# EAGLE schematic misko_1_board (EAGLE 9.6.2)
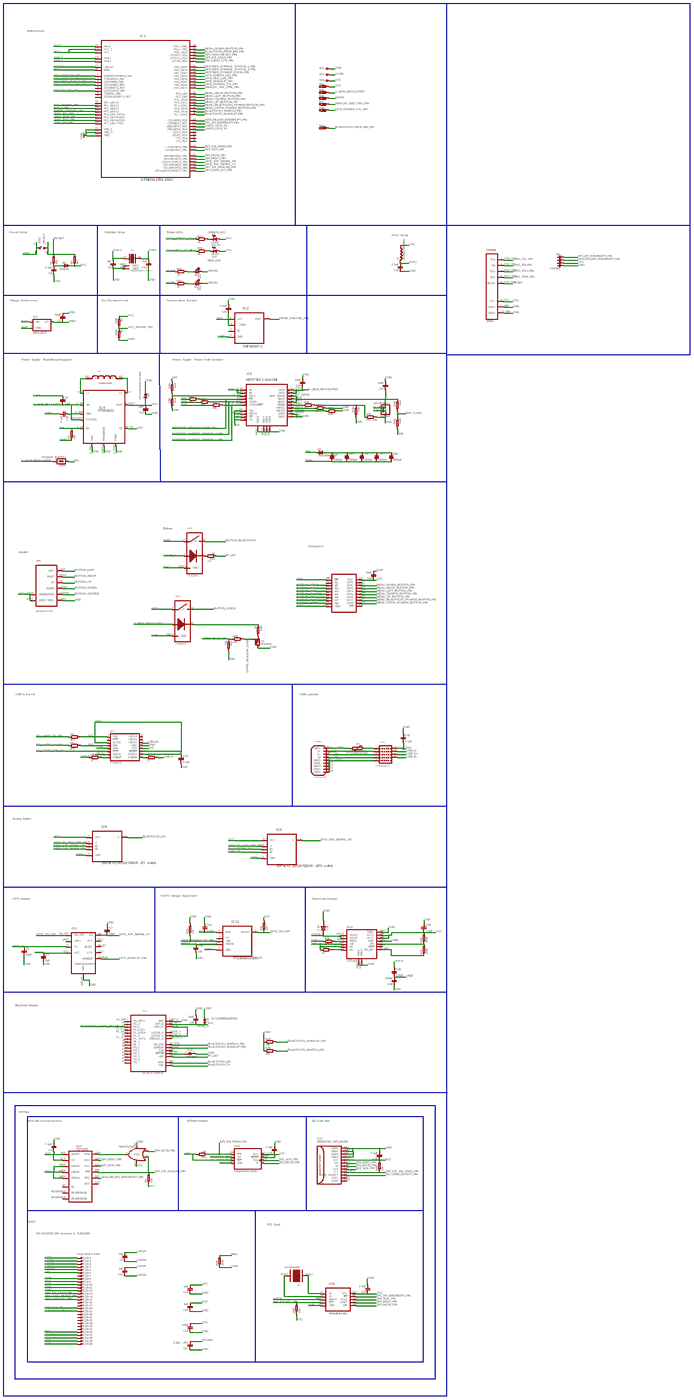
[diagram p0: schematic, sheet 1, overview]
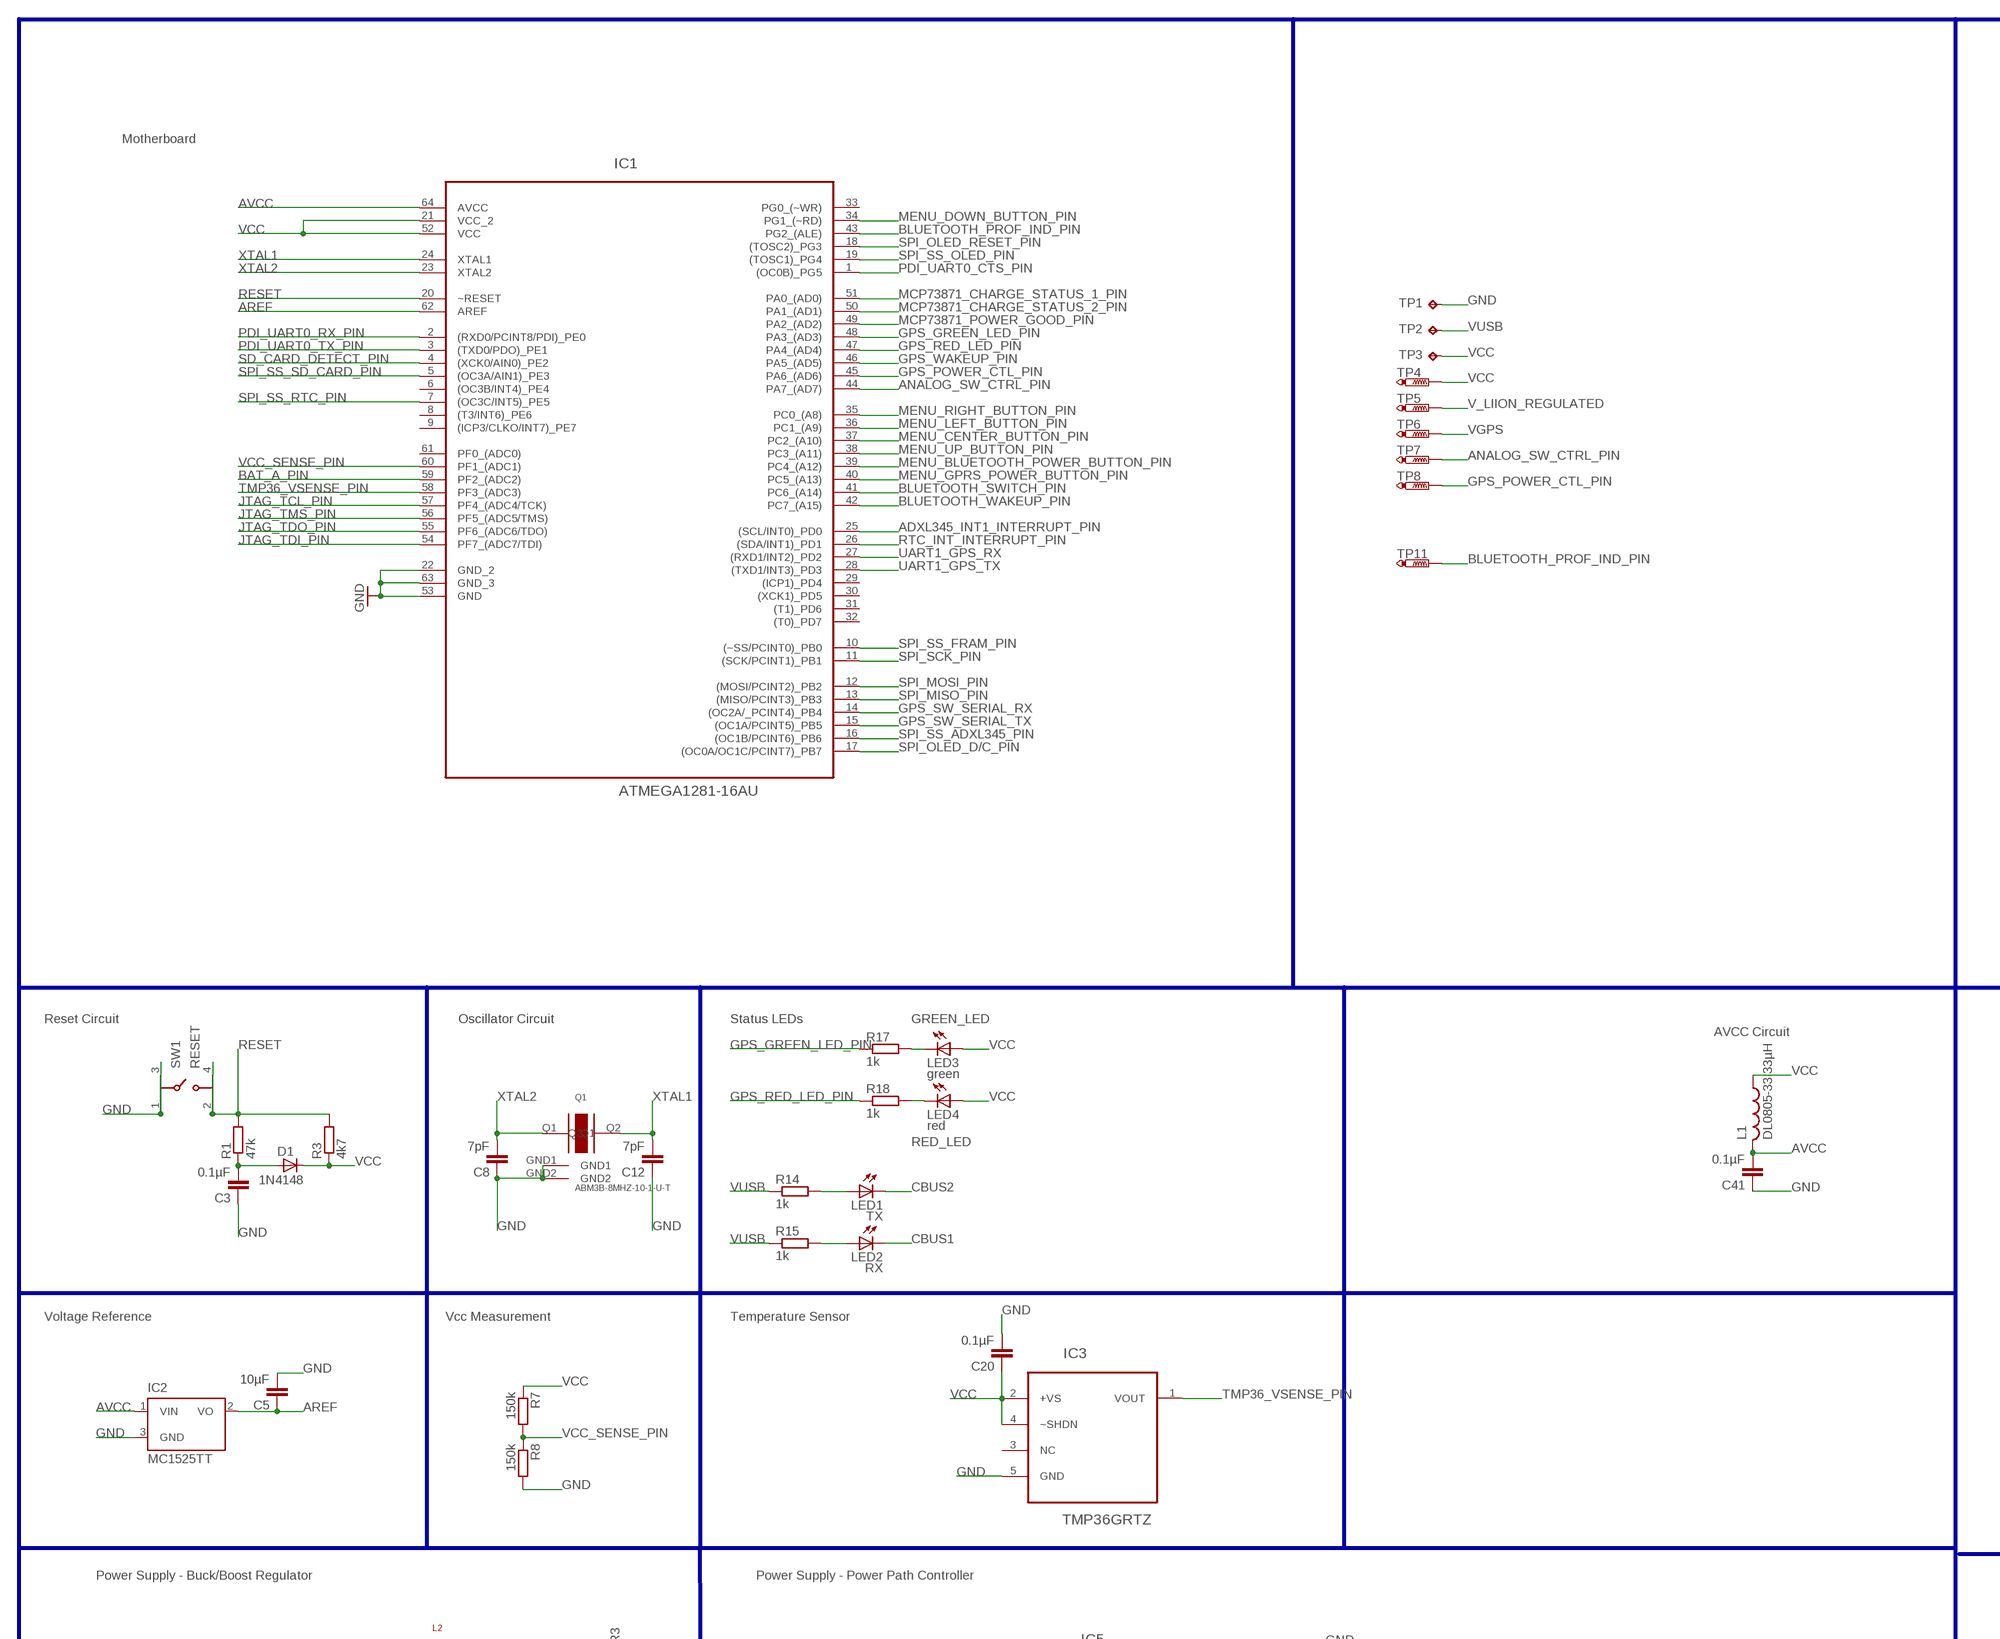
[diagram p1: schematic, sheet 1, part 1 of 5]
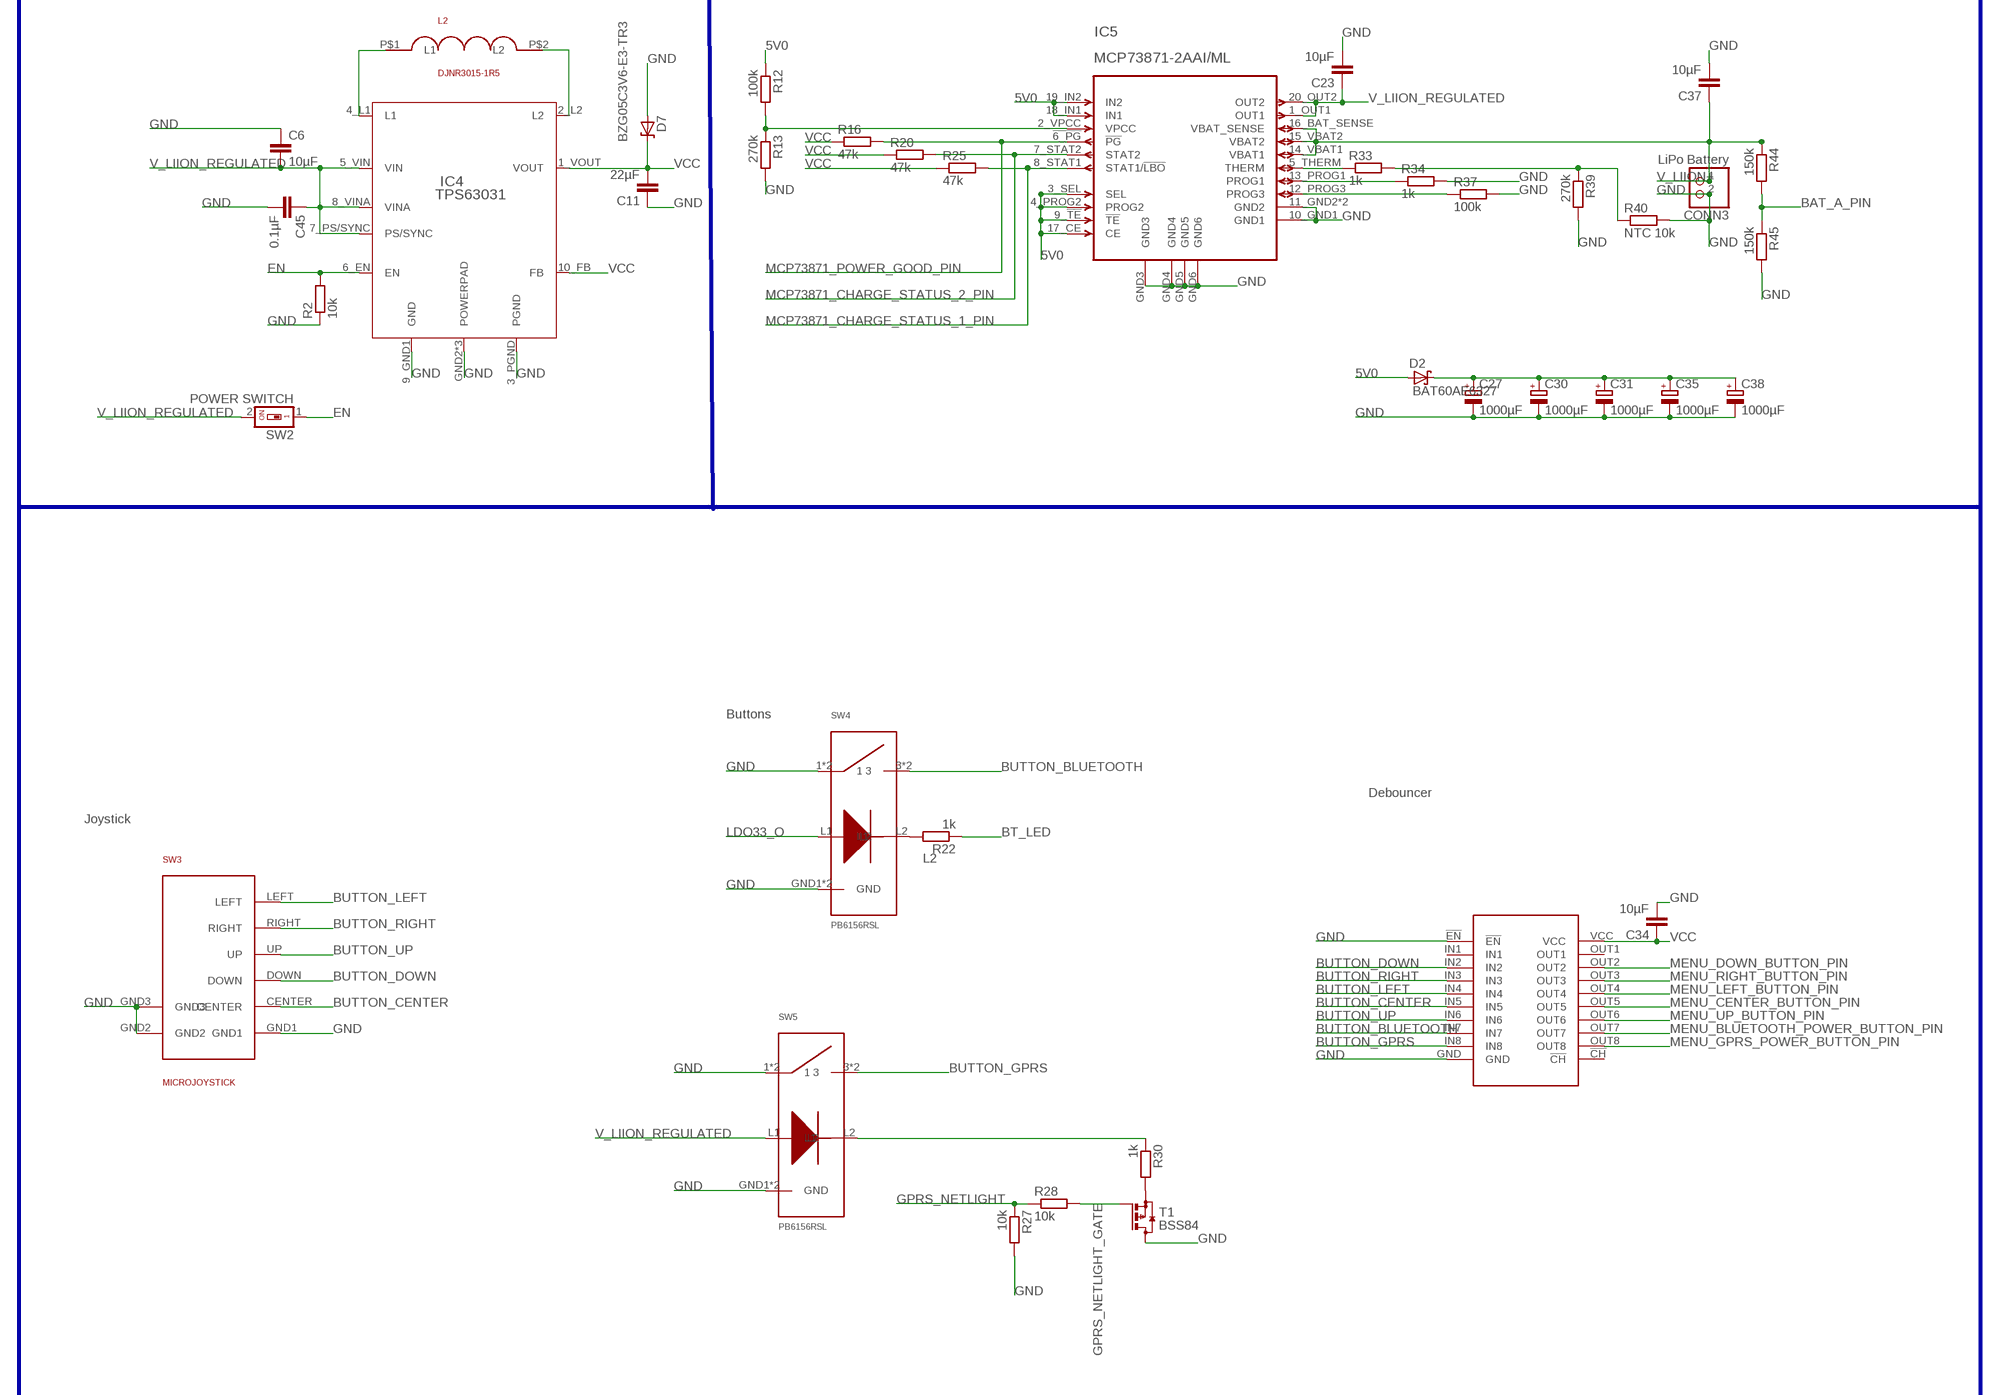
[diagram p2: schematic, sheet 1, part 2 of 5]
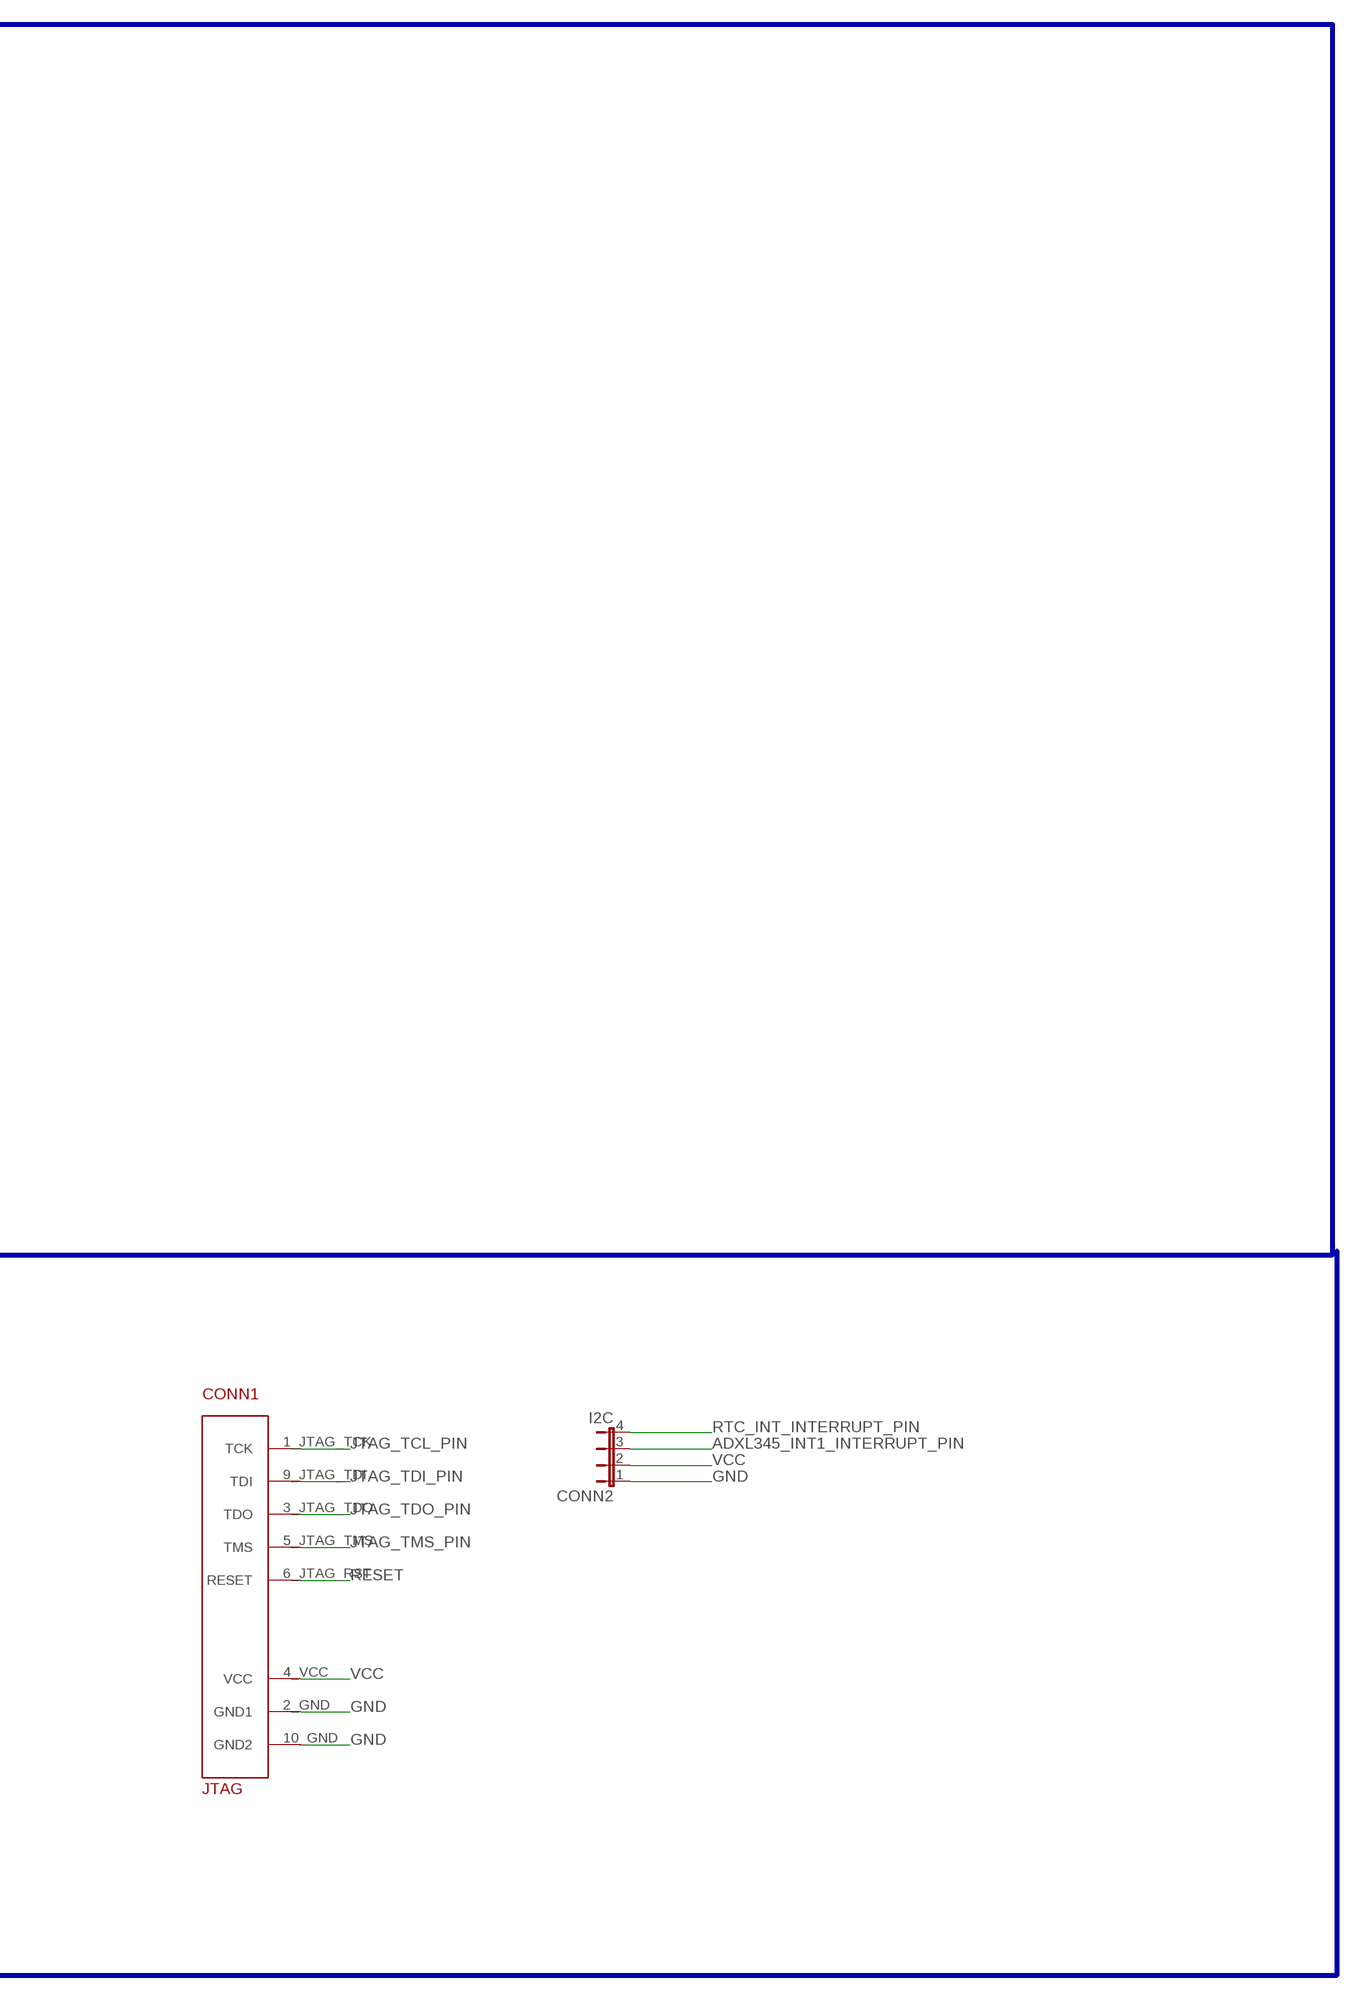
[diagram p3: schematic, sheet 1, part 3 of 5]
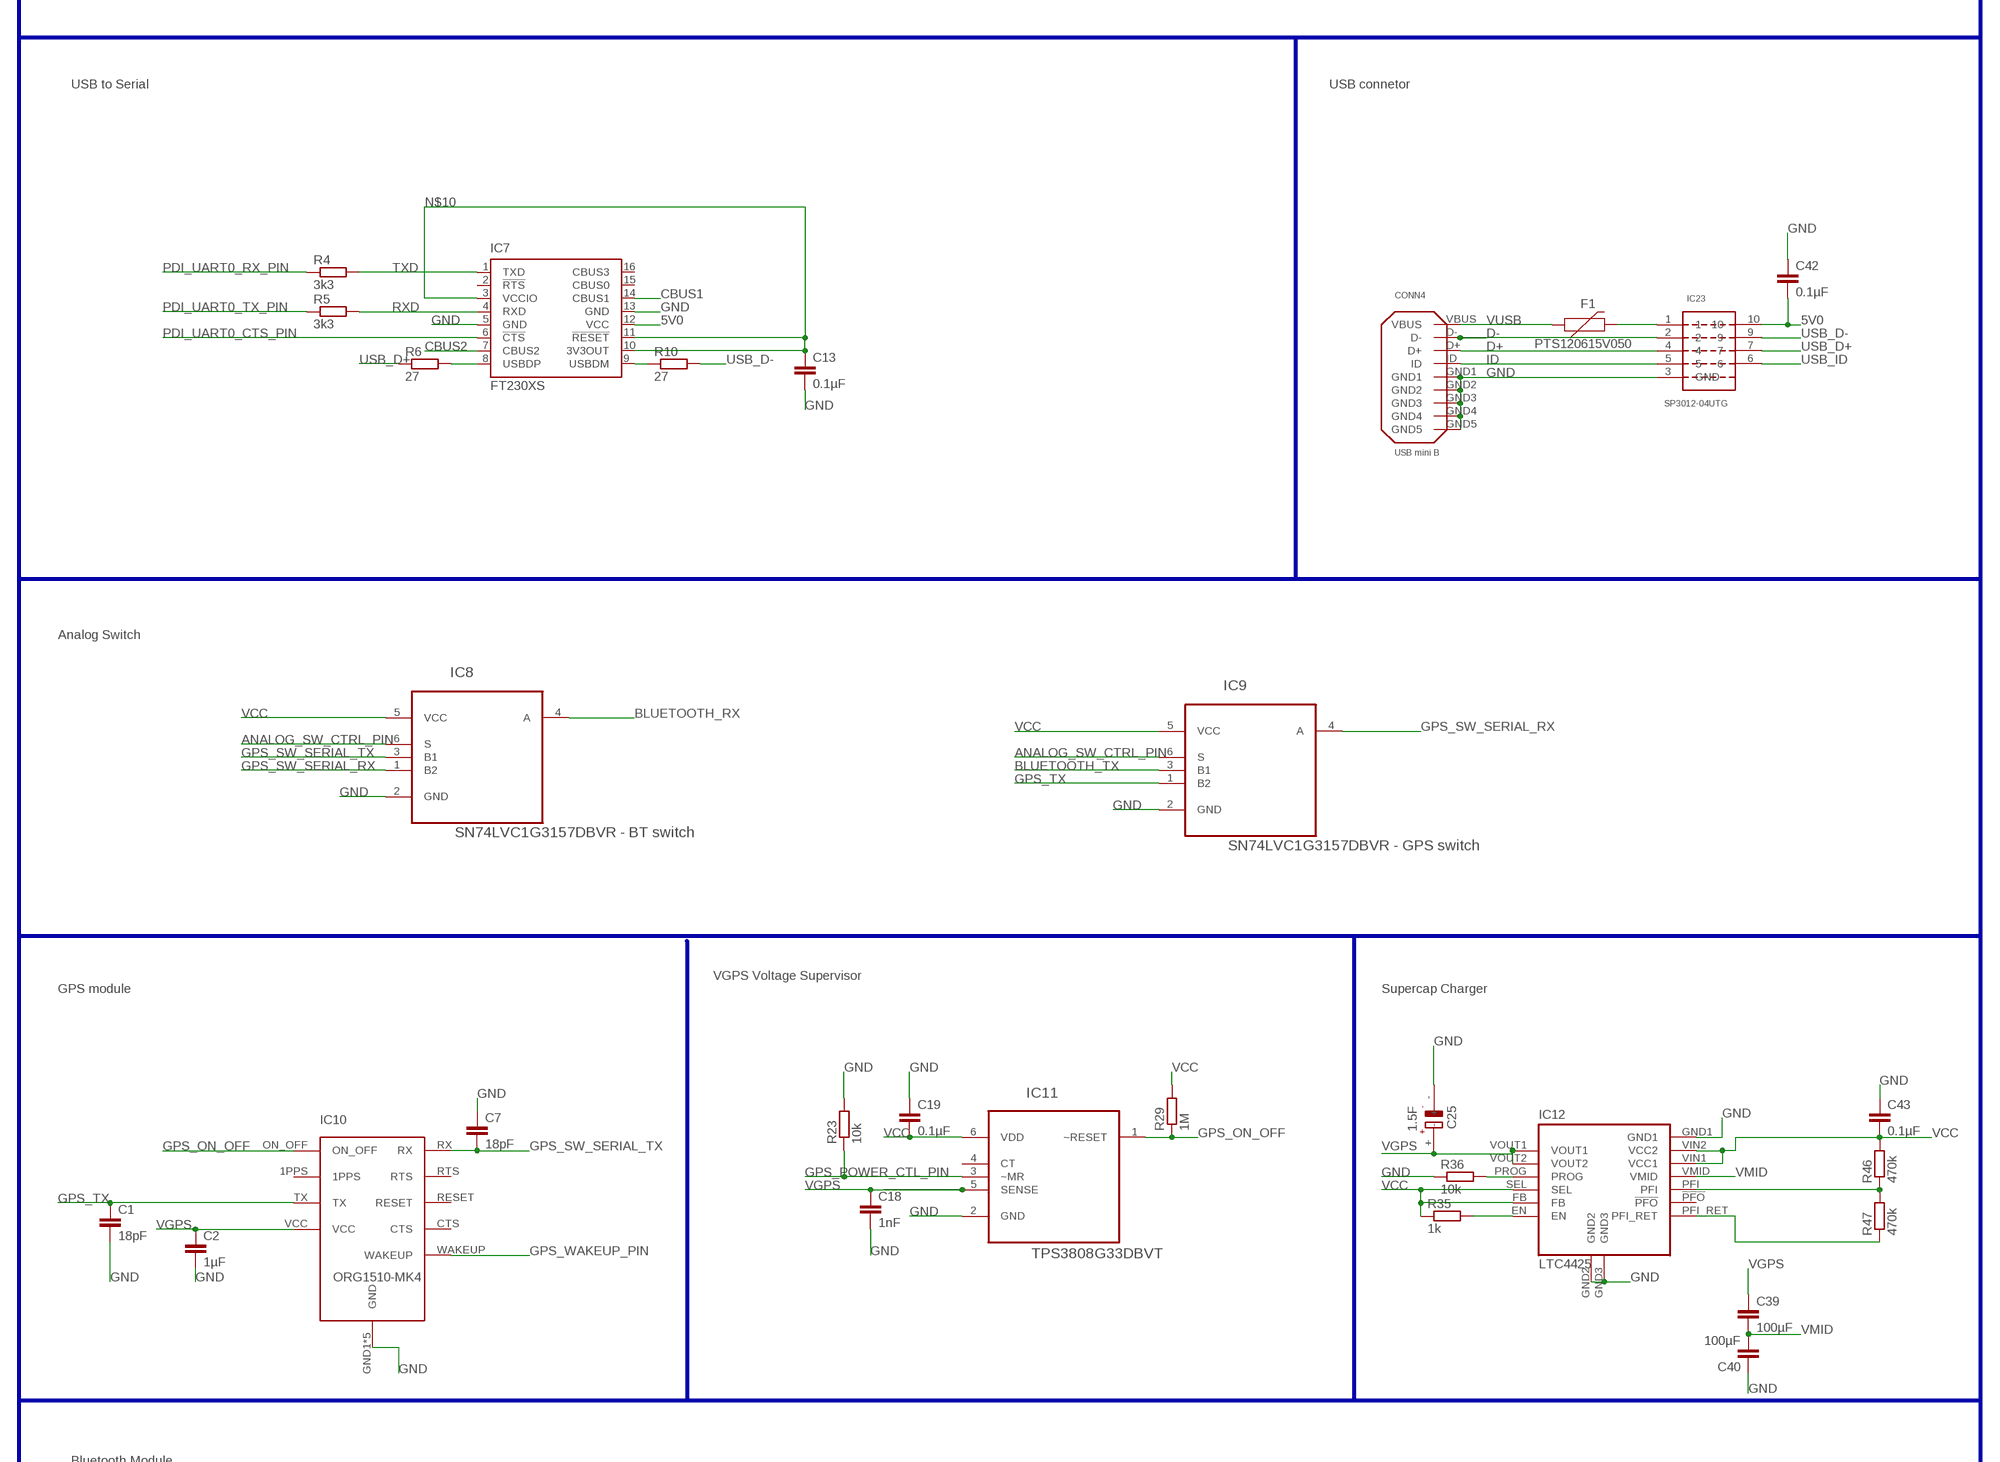
[diagram p4: schematic, sheet 1, part 4 of 5]
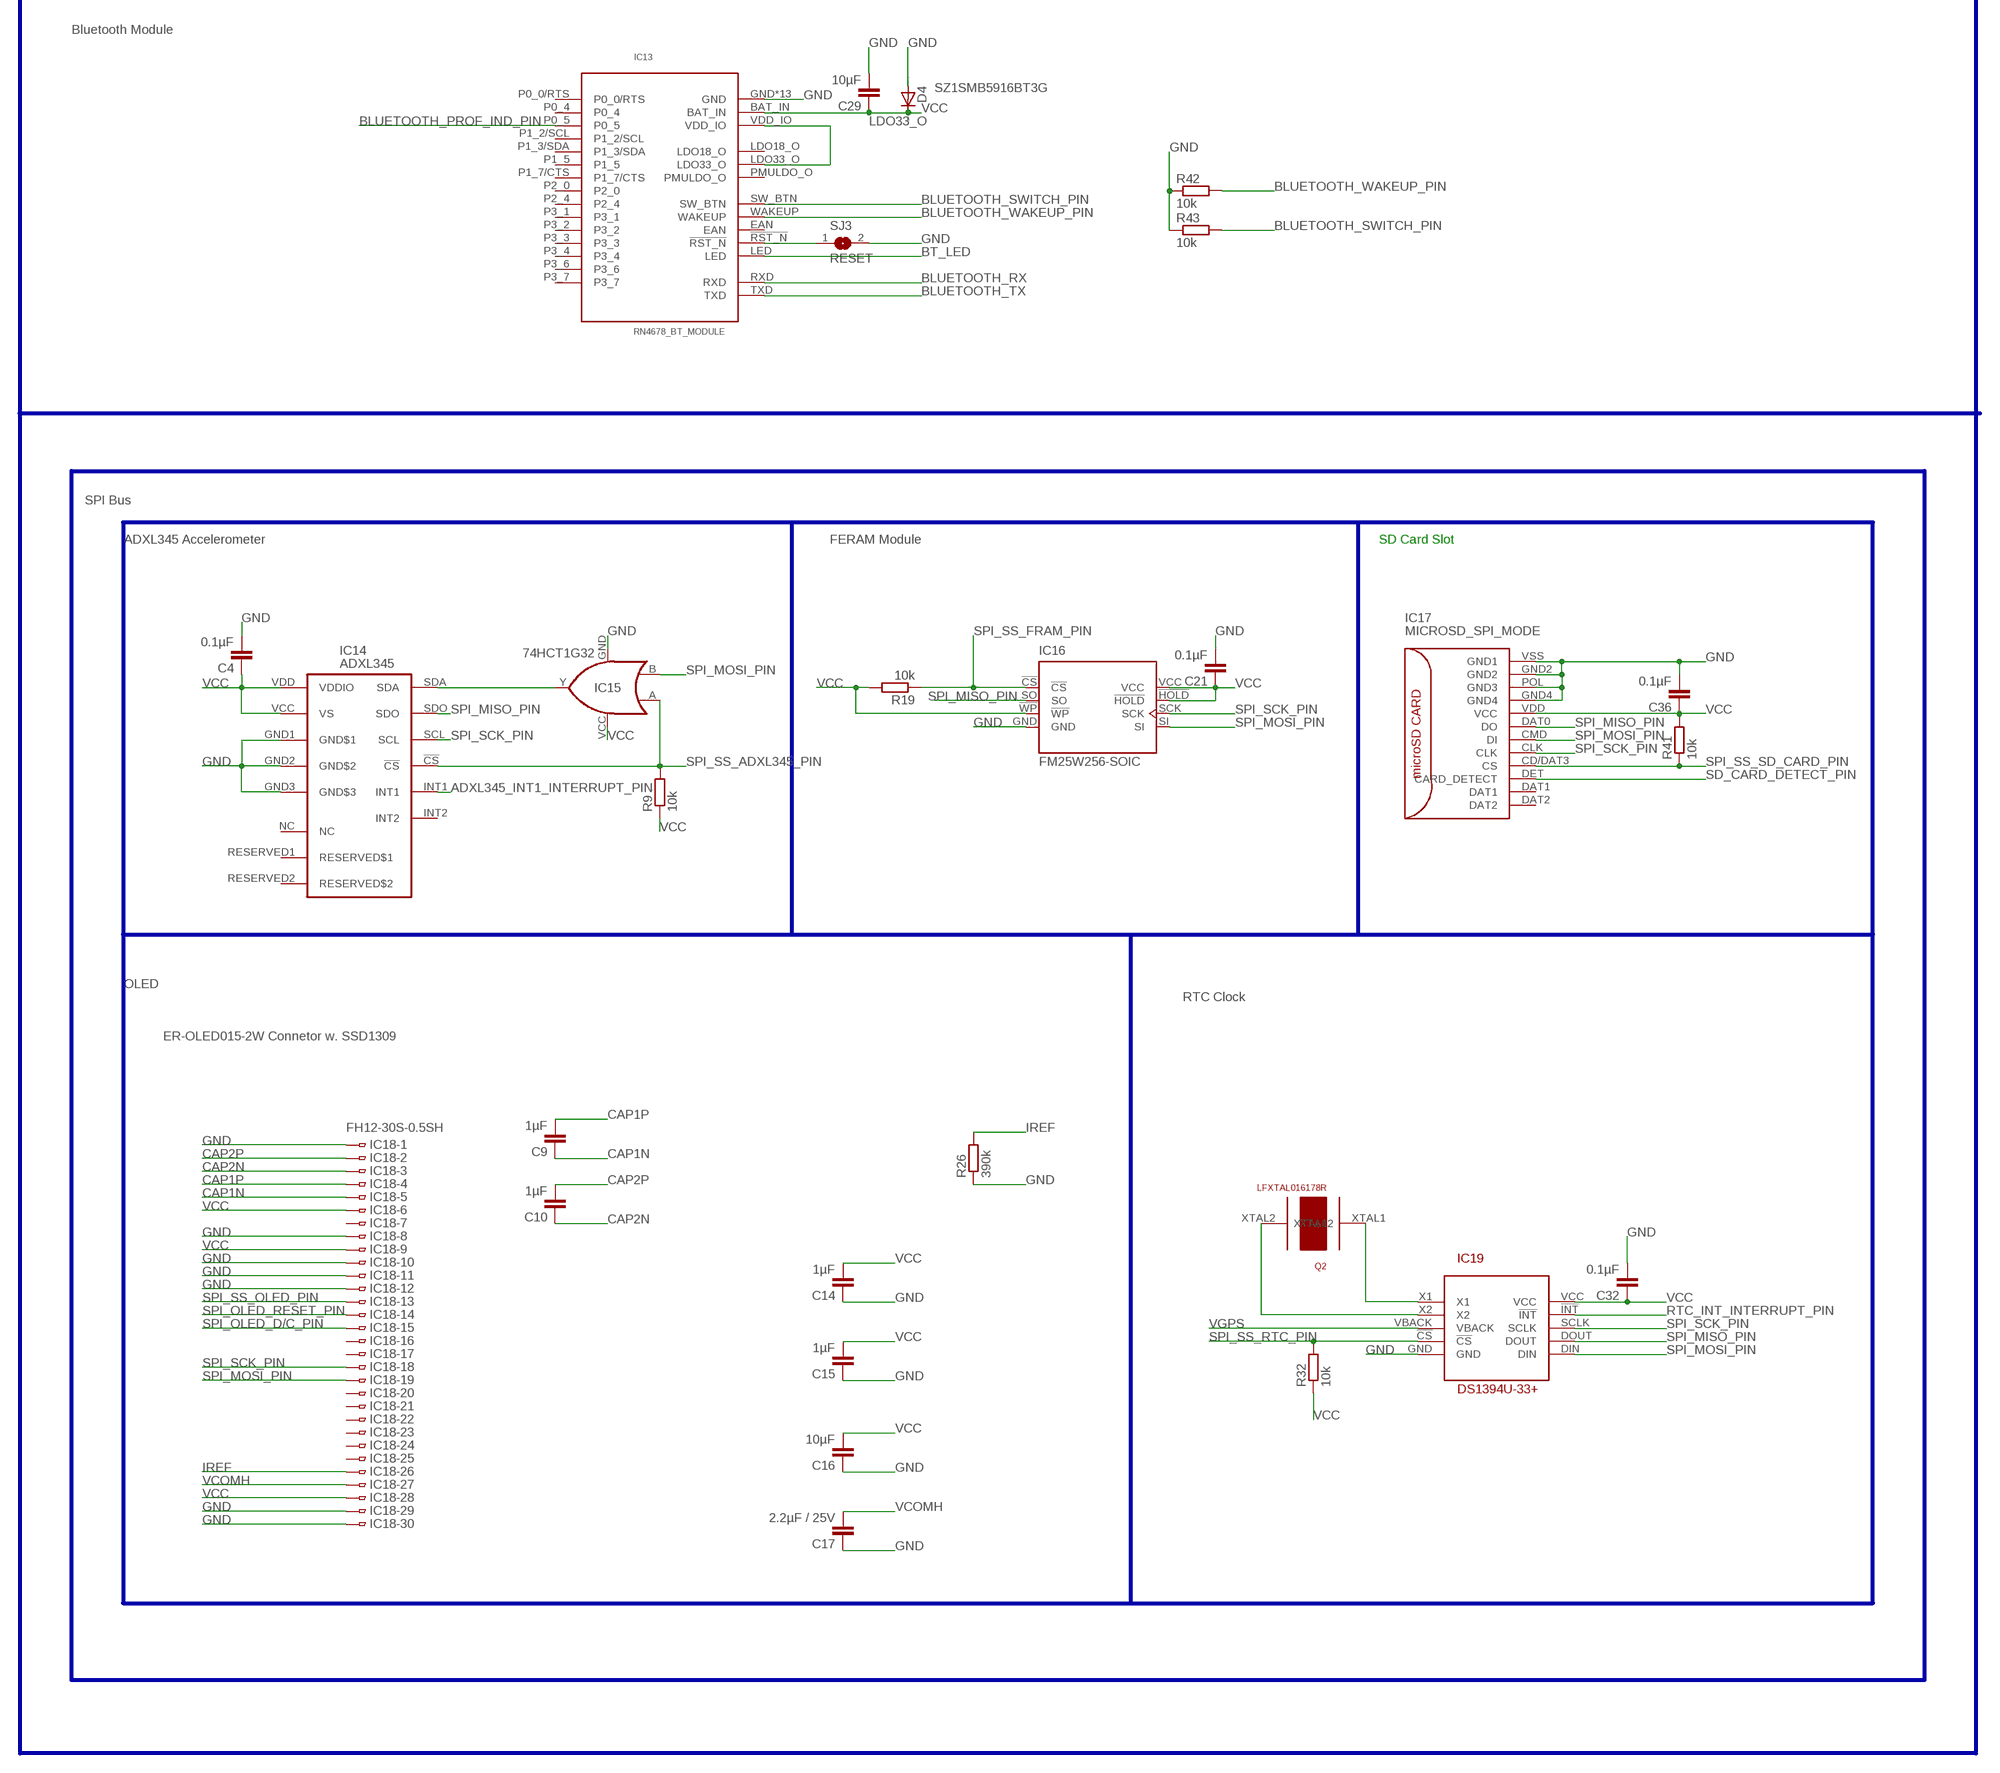
[diagram p5: schematic, sheet 1, part 5 of 5]

## Parts
C1  18pF  C-EUC0805  [C0805]
C2  1µF  C-EUC0805  [C0805]
C3  0.1µF  C-EUC0805  [C0805]
C4  0.1µF  C-EUC0805  [C0805]
C5  10µF  C-EUC0805  [C0805]
C6  10µF  C-EUC0805  [C0805]
C7  18pF  C-EUC0805  [C0805]
C8  7pF  C-EUC0805  [C0805]
C9  1µF  C-EUC0805  [C0805]
C10  1µF  C-EUC0805  [C0805]
C11  22µF  C-EUC0805  [C0805]
C12  7pF  C-EUC0805  [C0805]
C13  0.1µF  C-EUC0805  [C0805]
C14  1µF  C-EUC0805  [C0805]
C15  1µF  C-EUC0805  [C0805]
C16  10µF  C-EUC0805  [C0805]
C17  2.2µF / 25V  C-EUC0805  [C0805]
C18  1nF  C-EUC0805  [C0805]
C19  0.1µF  C-EUC0805  [C0805]
C20  0.1µF  C-EUC0805  [C0805]
C21  0.1µF  C-EUC0805  [C0805]
C23  10µF  C-EUC0805  [C0805]
C25  1.5F  EECS5R5H155  [TH]
C27  1000µF  CPOL-EUE5-10.5  [E5-10,5]
C29  10µF  C-EUC0805  [C0805]
C30  1000µF  CPOL-EUE5-10.5  [E5-10,5]
C31  1000µF  CPOL-EUE5-10.5  [E5-10,5]
C32  0.1µF  C-EUC0805  [C0805]
C34  10µF  C-EUC0805  [C0805]
C35  1000µF  CPOL-EUE5-10.5  [E5-10,5]
C36  0.1µF  C-EUC0805  [C0805]
C37  10µF  C-EUC0805  [C0805]
C38  1000µF  CPOL-EUE5-10.5  [E5-10,5]
C39  100µF  C-EUC0805  [C0805]
C40  100µF  C-EUC0805  [C0805]
C41  0.1µF  C-EUC0805  [C0805]
C42  0.1µF  C-EUC0805  [C0805]
C43  0.1µF  C-EUC0805  [C0805]
C45  0.1µF  C-EUC0805  [C0805]
CONN1  JTAG  JTAG-1.27-10-PIN-HEADER  [TH-JTAG]
CONN2  I2C  JP4E  [JP4]
CONN3  LiPo Battery  JST_2PIN-THM-RA  [JST-PH-2-THM-RA]
CONN4  USB mini B  MX-67503-1230  [SMT]
D1  1N4148  [D0805]
D2  BAT60AE6327  BAT60J  [SOD323_ST]
D4  SZ1SMB5916BT3G  DIODE-SMB  [SMB]
D7  BZG05C3V6-E3-TR3  ZENER  [DO-214]
F1  PTS120615V050  PPTC_THREE-QUARTER-AMP  [1206]
IC1  ATMEGA1281-16AU  [QFP80P1600X1600X120-64N]
IC2  MC1525TT  [SOT23]
IC3  TMP36GRTZ  TMP36GRTZ-REEL7  [SOT95P280X145-5N]
IC4  TPS63031  TPS63001DRCR  [SMT]
IC5  MCP73871-2AAI/ML  [QFN50P400X400X100-21N]
IC6  MAX6818  [TSSOP20]
IC7  FT230XS  [SSOP16]
IC8  SN74LVC1G3157DBVR - BT switch  SN74LVC1G3157DBVR  [SOT95P280X145-6N]
IC9  SN74LVC1G3157DBVR - GPS switch  SN74LVC1G3157DBVR  [SOT95P280X145-6N]
IC10  ORG1510-MK4  [PACKAGE]
IC11  TPS3808G33DBVT  [SOT95P280X145-6N]
IC12  LTC4425  [MSOP]
IC13  RN4678_BT_MODULE  [SMT]
IC14  ADXL345  [LGA14]
IC15  74HCT1G32  74HCT1G32GW-DC  [SOT353/5]
IC16  FM25W256-SOIC  [SOIC08]
IC17  MICROSD_SPI_MODE  [MICRO_SD_CONNECTOR]
IC18  FH12-30S-0.5SH  [FH12-30S-0.5SH]
IC19  DS1394U-33+  [10UMAX]
IC23  SP3012-04UTG  [μDFN-10]
L1  DL0805-33 33µH  L-US  [L0805]
L2  DJNR3015-1R5  [FFF]
LED1  TX  LEDCHIPLED_1206  [CHIPLED_1206]
LED2  RX  LEDCHIPLED_1206  [CHIPLED_1206]
LED3  green  LEDSQR2X5  [LED2X5]
LED4  red  LEDSQR2X5  [LED2X5]
Q1  ABM3B-8MHZ-10-1-U-T  ABM3B  [SMT]
Q2  LFXTAL016178R  [SMD]
R1  47k  R-EU_R0805  [R0805]
R2  10k  R-EU_R0805  [R0805]
R3  4k7  R-EU_R0805  [R0805]
R4  3k3  R-EU_R0805  [R0805]
R5  3k3  R-EU_R0805  [R0805]
R6  27  R-EU_R0805  [R0805]
R7  150k  R-EU_R0805  [R0805]
R8  150k  R-EU_R0805  [R0805]
R9  10k  R-EU_R0805  [R0805]
R10  27  R-EU_R0805  [R0805]
R12  100k  R-EU_R0805  [R0805]
R13  270k  R-EU_R0805  [R0805]
R14  1k  R-EU_R0805  [R0805]
R15  1k  R-EU_R0805  [R0805]
R16  47k  R-EU_R0805  [R0805]
R17  1k  R-EU_R0805  [R0805]
R18  1k  R-EU_R0805  [R0805]
R19  10k  R-EU_R0805  [R0805]
R20  47k  R-EU_R0805  [R0805]
R22  1k  R-EU_R0805  [R0805]
R23  10k  R-EU_R0805  [R0805]
R25  47k  R-EU_R0805  [R0805]
R26  390k  R-EU_R0805  [R0805]
R27  10k  R-EU_R0805  [R0805]
R28  10k  R-EU_R0805  [R0805]
R29  1M  R-EU_R0805  [R0805]
R30  1k  R-EU_R0805  [R0805]
R32  10k  R-EU_R0805  [R0805]
R33  1k  R-EU_R0805  [R0805]
R34  1k  R-EU_R0805  [R0805]
R35  1k  R-EU_R0805  [R0805]
R36  10k  R-EU_R0805  [R0805]
R37  100k  R-EU_R0805  [R0805]
R39  270k  R-EU_R0805  [R0805]
R40  NTC 10k  R-EU_0204/5  [0204/5]
R41  10k  R-EU_R0805  [R0805]
R42  10k  R-EU_R0805  [R0805]
R43  10k  R-EU_R0805  [R0805]
R44  150k  R-EU_R0805  [R0805]
R45  150k  R-EU_R0805  [R0805]
R46  470k  R-EU_R0805  [R0805]
R47  470k  R-EU_R0805  [R0805]
SJ3  RESET  SJW  [SJW]
SW1  RESET  430152050836  [430152050836]
SW2  POWER SWITCH  SWS001  [SMS-001]
SW3  MICROJOYSTICK  [MICROJOYSTICK]
SW4  PB6156RSL  [TH]
SW5  PB6156RSL  [TH]
T1  BSS84  [SOT23]
TP1  GND  TPPAD1-17Y  [P1-17Y]
TP2  GND  TPPAD1-17Y  [P1-17Y]
TP3  GND  TPPAD1-17Y  [P1-17Y]
TP4  VCC  PTR1TP14R  [TP14R]
TP5  VLiIon Regulated  PTR1TP14R  [TP14R]
TP6  VGPS  PTR1TP14R  [TP14R]
TP7  Analogue Switch CRTL Pin  PTR1TP14R  [TP14R]
TP8  GPS Power CTRL Pin  PTR1B1,27  [B1,27]
TP11  Bluetooth Wakeup Pin  PTR1TP14R  [TP14R]

## Nets
5V0 [VCC]: C42.2 D2.A IC5.3_SEL(SEL) IC5.4_PROG2(PROG2) IC5.9_!TE!(!TE!) IC5.17_CE(CE) IC5.18_IN1(IN1) IC5.19_IN2(IN2) IC7.12(VCC) IC23.10 R12.1
ADXL345_INT1_INTERRUPT_PIN [signal]: CONN2.3 IC1.25((SCL/INT0)_PD0) IC14.INT1
ADXL345SDA [signal]: IC14.SDA IC15.Y
ANALOG_SW_CTRL_PIN [signal cross-board]: IC1.44(PA7_(AD7)) IC8.6(S) IC9.6(S) TP7.TP
AREF [signal]: C5.1 IC1.62(AREF) IC2.2(VO)
AVCC [signal]: C41.2 IC1.64(AVCC) IC2.1(VIN) L1.2
BAT_A_PIN [signal]: IC1.59(PF2_(ADC2)) R44.2 R45.1
BLUETOOTH_PROF_IND_PIN [signal]: IC1.43(PG2_(ALE)) IC13.P0_5 TP11.TP
BLUETOOTH_RX [signal]: IC8.4(A) IC13.RXD
BLUETOOTH_SWITCH_PIN [signal]: IC1.41(PC6_(A14)) IC13.SW_BTN R43.2
BLUETOOTH_TX [signal]: IC9.3(B1) IC13.TXD
BLUETOOTH_WAKEUP_PIN [signal cross-board]: IC1.42(PC7_(A15)) IC13.WAKEUP R42.2
BT_LED [signal]: IC13.LED R22.1
BUTTON_BLUETOOTH [signal cross-board]: IC6.IN7 SW4.3 SW4.4
BUTTON_CENTER [signal]: IC6.IN5 SW3.CENTER
BUTTON_DOWN [signal]: IC6.IN2 SW3.DOWN
BUTTON_GPRS [signal cross-board]: IC6.IN8 SW5.3 SW5.4
BUTTON_LEFT [signal]: IC6.IN4 SW3.LEFT
BUTTON_RIGHT [signal]: IC6.IN3 SW3.RIGHT
BUTTON_UP [signal]: IC6.IN6 SW3.UP
CAP1N [signal]: C9.1 IC18.5
CAP1P [signal]: C9.2 IC18.4
CAP2N [signal]: C10.1 IC18.3
CAP2P [signal]: C10.2 IC18.2
CBUS1 [signal]: IC7.14(CBUS1) LED2.C
CBUS2 [signal]: IC7.7(CBUS2) LED1.C
D+ [signal]: CONN4.D+ IC23.4
D- [signal]: CONN4.D- IC23.2
EN [signal cross-board]: IC4.6_EN(EN) R2.2 SW2.1
GND: C1.2 C2.2 C3.1 C4.2 C5.2 C6.1 C7.1 C8.1 C11.1 C12.1 C13.2 C14.1 C15.1 C16.1 C17.1 C18.2 C19.1 C20.2 C21.2 C23.2 C25.- C27.- C29.2 C30.- C31.- C32.2 C34.2 C35.- C36.2 C37.2 C38.- C40.1 C41.1 C42.1 C43.1 C45.2 CONN1.2_GND(GND1) CONN1.10_GND(GND2) CONN2.1 CONN3.2 CONN4.GND1 CONN4.GND2 CONN4.GND3 CONN4.GND4 CONN4.GND5 D4.A D7.AN IC1.22(GND_2) IC1.53(GND) IC1.63(GND_3) IC2.3(GND) IC3.5(GND) IC4.3_PGND(PGND) IC4.9_GND1(GND) IC4.GND2(POWERPAD) IC4.GND3(POWERPAD) IC4.GND4(POWERPAD) IC5.10_GND1(GND1) IC5.11_GND2(GND2) IC5.GND2 IC5.GND3 IC5.GND4 IC5.GND5 IC5.GND6 IC6.!EN! IC6.GND IC7.5(GND) IC7.13(GND) IC8.2(GND) IC9.2(GND) IC10.GND1(GND) IC10.GND2(GND) IC10.GND3(GND) IC10.GND4(GND) IC10.GND5(GND) IC11.2(GND) IC12.GND1 IC12.GND2 IC12.GND3 IC13.GND IC13.GND1(GND) IC13.GND2(GND) IC13.GND3(GND) IC13.GND4(GND) IC13.GND5(GND) IC13.GND6(GND) IC13.GND7(GND) IC13.GND8(GND) IC13.GND9(GND) IC13.GND10(GND) IC13.GND11(GND) IC13.GND12(GND) IC14.GND1(GND$1) IC14.GND2(GND$2) IC14.GND3(GND$3) IC15.GND IC16.GND IC17.GND2 IC17.GND4 IC17.POL(GND3) IC17.VSS(GND1) IC18.1 IC18.8 IC18.10 IC18.11 IC18.12 IC18.29 IC18.30 IC19.GND IC23.3(GND) Q1.GND1 Q1.GND2 R2.1 R8.2 R13.2 R23.2 R26.1 R27.2 R34.2 R36.1 R37.2 R39.2 R40.2 R42.1 R43.1 R45.2 SJ3.2 SW1.1 SW1.3 SW3.GND1 SW3.GND2 SW3.GND3 SW4.1 SW4.2 SW4.GND1(GND) SW4.GND2(GND) SW5.1 SW5.2 SW5.GND1(GND) SW5.GND2(GND) T1.3(D) TP1.TP
GPRS_NETLIGHT [signal cross-board]: R27.1 R28.1
GPRS_NETLIGHT_GATE [signal]: R28.2 T1.1(G)
GPS_GREEN_LED_PIN [signal cross-board]: IC1.48(PA3_(AD3)) R17.1
GPS_ON_OFF [signal cross-board]: IC10.ON_OFF IC11.1(~RESET) R29.1
GPS_POWER_CTL_PIN [signal]: IC1.45(PA6_(AD6)) IC11.3(~MR) R23.1 TP8.TP
GPS_RED_LED_PIN [signal cross-board]: IC1.47(PA4_(AD4)) R18.1
GPS_SW_SERIAL_RX [signal cross-board]: IC1.14((OC2A/_PCINT4)_PB4) IC8.1(B2) IC9.4(A)
GPS_SW_SERIAL_TX [signal cross-board]: C7.2 IC1.15((OC1A/PCINT5)_PB5) IC8.3(B1) IC10.RX
GPS_TX [signal cross-board]: C1.1 IC9.1(B2) IC10.TX
GPS_WAKEUP_PIN [signal cross-board]: IC1.46(PA5_(AD5)) IC10.WAKEUP
GREEN_LED [signal cross-board]: LED3.K(C) R17.2
ID: CONN4.ID IC23.5
IREF [signal]: IC18.26 R26.2
JTAG_TCL_PIN [signal cross-board]: CONN1.1_JTAG_TCK(TCK) IC1.57(PF4_(ADC4/TCK))
JTAG_TDI_PIN [signal cross-board]: CONN1.9_JTAG_TDI(TDI) IC1.54(PF7_(ADC7/TDI))
JTAG_TDO_PIN [signal cross-board]: CONN1.3_JTAG_TDO(TDO) IC1.55(PF6_(ADC6/TDO))
JTAG_TMS_PIN [signal cross-board]: CONN1.5_JTAG_TMS(TMS) IC1.56(PF5_(ADC5/TMS))
L2 [signal]: R22.2 SW4.L2
L_L1 [signal]: IC4.4_L1(L1) L2.P$1(L1)
L_L2 [signal]: IC4.2_L2(L2) L2.P$2(L2)
LDO33_O [VCC]: IC13.LDO33_O IC13.VDD_IO SW4.L1
LTC4425_EN [signal]: IC12.EN R35.2
LTC4425_PROG [signal]: IC12.PROG R36.2
MCP73871_CHARGE_STATUS_1_PIN [signal]: IC1.51(PA0_(AD0)) IC5.8_STAT1(STAT1/!LBO!) R25.2
MCP73871_CHARGE_STATUS_2_PIN [signal]: IC1.50(PA1_(AD1)) IC5.7_STAT2(STAT2) R20.2
MCP73871_POWER_GOOD_PIN [signal]: IC1.49(PA2_(AD2)) IC5.!6_PG!(!PG!) R16.2
MENU_BLUETOOTH_POWER_BUTTON_PIN [signal]: IC1.39(PC4_(A12)) IC6.OUT7
MENU_CENTER_BUTTON_PIN [signal]: IC1.37(PC2_(A10)) IC6.OUT5
MENU_DOWN_BUTTON_PIN [signal]: IC1.34(PG1_(~RD)) IC6.OUT2
MENU_GPRS_POWER_BUTTON_PIN [signal]: IC1.40(PC5_(A13)) IC6.OUT8
MENU_LEFT_BUTTON_PIN [signal]: IC1.36(PC1_(A9)) IC6.OUT4
MENU_RIGHT_BUTTON_PIN [signal]: IC1.35(PC0_(A8)) IC6.OUT3
MENU_UP_BUTTON_PIN [signal]: IC1.38(PC3_(A11)) IC6.OUT6
N$1 [signal]: R30.1 SW5.L2
N$3 [signal]: R30.2 T1.2(S)
N$4 [VCC]: F1.2 IC23.1
N$6: C27.+ C30.+ C31.+ C35.+ C38.+ D2.C
N$10 [signal]: C13.1 IC7.3(VCCIO) IC7.10(3V3OUT) IC7.11(!RESET)
N$11 [signal]: IC13.!RST_N! SJ3.1
N$19 [signal]: R33.2 R39.1 R40.1
N$31 [signal]: C3.2 D1.A R1.1
PDI_UART0_CTS_PIN [signal cross-board]: IC1.1((OC0B)_PG5) IC7.6(!CTS)
PDI_UART0_RX_PIN [signal cross-board]: IC1.2((RXD0/PCINT8/PDI)_PE0) R4.1
PDI_UART0_TX_PIN [signal cross-board]: IC1.3((TXD0/PDO)_PE1) R5.1
PFI [signal]: IC12.PFI R46.1 R47.2
PFI_RET [signal]: IC12.PFI_RET R47.1
PROG1 [signal]: IC5.13_PROG1(PROG1) R34.1
PROG3 [signal]: IC5.12_PROG3(PROG3) R37.1
RED_LED [signal cross-board]: LED4.K(C) R18.2
RESET [signal cross-board]: CONN1.6_JTAG_RST(RESET) IC1.20(~RESET) R1.2 R3.2 SW1.2 SW1.4
RTC_INT_INTERRUPT_PIN [signal cross-board]: CONN2.4 IC1.26((SDA/INT1)_PD1) IC19.!INT!
RTC_XTAL1 [signal]: IC19.X1 Q2.XTAL1
RTC_XTAL2 [signal]: IC19.X2 Q2.XTAL2
RXD [signal cross-board]: IC7.4(RXD) R5.2
SD_CARD_DETECT_PIN [signal]: IC1.4((XCK0/AIN0)_PE2) IC17.DET(CARD_DETECT)
SPI_MISO_PIN [signal]: IC1.13((MISO/PCINT3)_PB3) IC14.SDO IC16.SO IC17.DAT0(DO) IC19.DOUT
SPI_MOSI_PIN [signal cross-board]: IC1.12((MOSI/PCINT2)_PB2) IC15.B IC16.SI IC17.CMD(DI) IC18.19 IC19.DIN
SPI_OLED_D/C_PIN [signal cross-board]: IC1.17((OC0A/OC1C/PCINT7)_PB7) IC18.15
SPI_OLED_RESET_PIN [signal cross-board]: IC1.18((TOSC2)_PG3) IC18.14
SPI_SCK_PIN [signal cross-board]: IC1.11((SCK/PCINT1)_PB1) IC14.SCL IC16.SCK IC17.CLK IC18.18 IC19.SCLK
SPI_SS_ADXL345_PIN [signal]: IC1.16((OC1B/PCINT6)_PB6) IC14.!CS! IC15.A R9.2
SPI_SS_FRAM_PIN [signal]: IC1.10((~SS/PCINT0)_PB0) IC16.!CS! R19.1
SPI_SS_OLED_PIN [signal cross-board]: IC1.19((TOSC1)_PG4) IC18.13
SPI_SS_RTC_PIN [signal cross-board]: IC1.7((OC3C/INT5)_PE5) IC19.!CS! R32.2
SPI_SS_SD_CARD_PIN [signal]: IC1.5((OC3A/AIN1)_PE3) IC17.CD/DAT3(CS) R41.1
THERM [signal]: IC5.5_THERM(THERM) R33.1
TMP36_VSENSE_PIN [signal]: IC1.58(PF3_(ADC3)) IC3.1(VOUT)
TXD [signal cross-board]: IC7.1(TXD) R4.2
UART1_GPS_RX: IC1.27((RXD1/INT2)_PD2)
UART1_GPS_TX: IC1.28((TXD1/INT3)_PD3)
USB_D+ [signal]: IC23.7 R6.1
USB_D- [signal]: IC23.9 R10.2
USB_ID: IC23.6
USB_RX_LED [signal]: LED1.A R14.2
USB_TX_LED [signal]: LED2.A R15.2
USBDM [signal]: IC7.9(USBDM) R10.1
USBDP [signal]: IC7.8(USBDP) R6.2
V_LIION+ [VCC]: C37.1 CONN3.1 IC5.14_VBAT1(VBAT1) IC5.15_VBAT2(VBAT2) IC5.16_BAT_SENSE(VBAT_SENSE) R44.1
V_LIION_REGULATED [VCC]: C6.2 C23.1 C45.1 IC4.5_VIN(VIN) IC4.7_PS/SYNC(PS/SYNC) IC4.8_VINA(VINA) IC5.1_OUT1(OUT1) IC5.20_OUT2(OUT2) SW2.2 SW5.L1 TP5.TP
VCC [VCC]: C4.1 C11.2 C14.2 C15.2 C16.2 C19.2 C20.1 C21.1 C29.1 C32.1 C34.1 C36.1 C43.2 CONN1.4_VCC(VCC) CONN2.2 D1.C D4.C D7.CAT IC1.21(VCC_2) IC1.52(VCC) IC3.2(+VS) IC3.4(~SHDN) IC4.1_VOUT(VOUT) IC4.10_FB(FB) IC6.VCC IC8.5(VCC) IC9.5(VCC) IC11.6(VDD) IC12.FB IC12.SEL IC12.VIN1(VCC1) IC12.VIN2(VCC2) IC13.BAT_IN IC14.VCC(VS) IC14.VDD(VDDIO) IC15.VCC IC16.!HOLD! IC16.!WP! IC16.VCC IC17.VDD(VCC) IC18.6 IC18.9 IC18.28 IC19.VCC L1.1 LED3.A LED4.A R3.1 R7.1 R9.1 R16.1 R19.2 R20.1 R25.1 R29.2 R32.1 R35.1 R41.2 R46.2 TP3.TP TP4.TP
VCC_SENSE_PIN [signal]: IC1.60(PF1_(ADC1)) R7.2 R8.1
VCOMH [signal]: C17.2 IC18.27
VGPS [VCC]: C2.1 C18.1 C25.+ C39.1 IC10.VCC IC11.5(SENSE) IC12.VOUT1 IC12.VOUT2 IC19.VBACK TP6.TP
VMID [signal]: C39.2 C40.2 IC12.VMID
VPCC [signal]: IC5.2_VPCC(VPCC) R12.2 R13.1
VUSB [VCC]: CONN4.VBUS F1.1 R14.1 R15.1 TP2.TP
XTAL1 [signal]: C12.2 IC1.24(XTAL1) Q1.Q2
XTAL2 [signal]: C8.2 IC1.23(XTAL2) Q1.Q1
Unconnected: IC1.6((OC3B/INT4)_PE4) IC1.8((T3/INT6)_PE6) IC1.9((ICP3/CLKO/INT7)_PE7) IC1.29((ICP1)_PD4) IC1.30((XCK1)_PD5) IC1.31((T1)_PD6) IC1.32((T0)_PD7) IC1.33(PG0_(~WR)) IC1.61(PF0_(ADC0)) IC3.3(NC) IC6.!CH! IC6.IN1 IC6.OUT1 IC7.2(!RTS) IC7.15(CBUS0) IC7.16(CBUS3) IC10.1PPS IC10.CTS IC10.RESET IC10.RTS IC11.4(CT) IC12.!PFO! IC13.EAN IC13.P0_0/RTS IC13.P0_4 IC13.P1_2/SCL IC13.P1_3/SDA IC13.P1_5 IC13.P1_7/CTS IC13.P2_0 IC13.P2_4 IC13.P3_1 IC13.P3_2 IC13.P3_3 IC13.P3_4 IC13.P3_6 IC13.P3_7 IC13.PMULDO_O IC14.INT2 IC14.NC IC14.RESERVED1(RESERVED$1) IC14.RESERVED2(RESERVED$2) IC17.DAT1 IC17.DAT2 IC18.7 IC18.16 IC18.17 IC18.20 IC18.21 IC18.22 IC18.23 IC18.24 IC18.25

## Buses
B$1
B$2
B$3
B$5
B$7
B$9
B$10

## Notes on the sheet
- Motherboard
- Reset Circuit | Oscillator Circuit | Status LEDs
- AVCC Circuit
- Voltage Reference | Vcc Measurement | Temperature Sensor
- Power Supply - Buck/Boost Regulator | Power Supply - Power Path Controller
- Buttons
- Debouncer
- Joystick
- USB to Serial | USB connetor
- Analog Switch
- VGPS Voltage Supervisor
- GPS module | Supercap Charger
- Bluetooth Module
- SPI Bus
- ADXL345 Accelerometer | FERAM Module | SD Card Slot
- OLED
- RTC Clock
- ER-OLED015-2W Connetor w. SSD1309

## Power pins joined to a net without a drawn wire
LDO18_O: IC13.LDO18_O

## Library data of the parts
C1 C4 C6 C9-C11 C14-C19 C21 C29 C32 C34 C36 C39 C40 C43 C45 = rcl:C-EU: CAPACITOR, European symbol
C2 C3 C5 C7 C8 C12 C13 C20 C23 C37 C41 C42 = resistor:C-EU: CAPACITOR, European symbol
C25 = EECS5R5H155 Supercap:EECS5R5H155
C27 C30 C31 C35 C38 = rcl:CPOL-EU: POLARIZED CAPACITOR, European symbol
CONN1 = JTAG 1.27mm 10pin header:JTAG-1.27-10-PIN-HEADER
CONN2 = jumper:JP4E: JUMPER
CONN3 = SIM800C:JST_2PIN: JST 2-Pin Connectors of various flavors SMT-RA (S2B-PH-SM4) 4UConnector #17311 SMT (B2B-PH-SM4) THM-RA (S2B-PH) THM (B2B-PH)
CONN4 = MX-67503-1230 USB Mini-B SMT straight socket:MX-67503-1230
D1 = Diode2:1N4148: DIODE high speed (Philips)
D2 = diode:BAT60J: Schottky barrier diode Source: www.st.com, BAT60J.pdf
D4 = diode:DIODE-: DIODE
D7 = zener:ZENER: Zener diode
F1 = SparkFun-Fuses:PPTC: Resettable Fuse PPTC Resettable Fuse. Really a sort of resistor with a polymeric positive temperature coefficient whose resistance increases dramatically with an increase in temperature. When heated by the power passing through the resistance rises causing the current to be limited, protecting the circuit. This is achieved by the transition of the polymer from a crystalline to an amorphous state where the conductive carbon separates breaking the conductive pathways found in the cool crystalline structure. When a PPTC cools back down it resumes conducting letting the circuit turn back on. SparkFun Products: SparkFun RedBoard - Programmed with Arduino <https://www.sparkfun.com/products/12757> Pro Micro - 5V/16MHz <https://www.sparkfun.com/products/12640> Arduino Pro 328 - 5V/16MHz <https://www.sparkfun.com/products/10915> MP3 Trigger <https://www.sparkfun.com/products/13720>; PROD_ID: RES-11150; VALUE: 6V/0.75A
IC1 = Atmel_By_element14_Batch_1-00:ATMEGA1281-16AU: Microcontroller; DESCRIPTION: Microcontroller; MPN: ATMEGA1281-16AU; OC_FARNELL: 1455092; OC_NEWARK: 58M3721; PACKAGE: QFP-64; SUPPLIER: ATMEL
IC2 = microchip:MC15*: 2.5V and 4.096V Voltage References Source: http://www.microchip.com .. 21653b.pdf; OC_FARNELL: unknown; OC_NEWARK: unknown
IC3 = TMP36GRTZ:TMP36GRTZ-REEL7: Low Voltage Temperature Sensors; MPN: TMP36GRTZ-REEL7; OC_FARNELL: 1661084; OC_NEWARK: 96K2116; PACKAGE: SOT23-5; SUPPLIER: Analog Devices
IC4 = TPS63031 - Buck Boost Voltage Regulator:TPS63001DRCR
IC5 = MCP73871 - Powerpath and Charge Controller:MCP73871-2AAI/ML: IC, BATTERY CHARGER, 1A; MPN: MCP73871-2AAI/ML; OC_FARNELL: 1642487; OC_NEWARK: 54M4955; PACKAGE: QFN-20; SUPPLIER: Microchip
IC6 = MAX6818 CMOS Switch debouncer:MAX6818
IC7 = ftdichip:FT230X: USB to BASIC UART IC Auto generated by make-symbol-device-package-bsdl.ulp Rev. 43 Source: Data sheet <http://www.ftdichip.com/Support/Documents/DataSheets/ICs/DS_FT230X.pdf>
IC8 IC9 = Texas Instruments_By_element14_Batch_1:SN74LVC1G3157DBVR: SINGLE-POLE, DOUBLE-THROW ANALOG SWITCH; MPN: SN74LVC1G3157DBVR; OC_FARNELL: 1470910; OC_NEWARK: 32H6364; PACKAGE: SOT-23-6; SUPPLIER: Texas Instruments
IC10 = ORG1510-MK4 GPS module:ORG1510-MK4
IC11 = Texas Instruments_By_element14_Batch_1:TPS3808G33DBVT: Low Quiescent Current, Programmable-Delay Supervisory Circuit; MPN: TPS3808G33DBVT; OC_FARNELL: 1755534; OC_NEWARK: 21J9211; PACKAGE: SOT-23-6; SUPPLIER: Texas Instruments
IC12 = LTC4425 Supercap Charger:LTC4425: The ISL85003 and ISL85003A are synchronous buck regulators with integrated high-side and low-side FET’s. The regulator can operate from an input voltage range of 4.5V to 18V while delivering a very efficient continuous 3A current. This is all delivered in a very compact 3x4mm DFN package. More about it you can find at ISL85003 <http://www.intersil.com/en/products/power-management/switching-regulators/integrated-fet-regulators/ISL85003.html> The library has been designed by Richard Magdycz <https://www.facebook.com/groups/eaglecadsoftUK>
IC13 = RN4678 Bluetooth 4.2 Dual Mode:RN4678_BT_MODULE
IC14 = ADXL345 Accelerometer:ADXL345: 3-Axis, ±2 g/±4 g/±8 g/±16 g Digital Accelerometer
IC15 = 74HCT1G32GW:74HCT1G32GW: Two Input OR gate
IC16 = FM25W256 FERAM:FM25W256: FeRAM Module; OC_FARNELL: unknown; OC_NEWARK: unknown
IC17 = Molex SD-47309 SD Card Slot:MICROSD_SPI_MODE: MOLEX - 49225-0821 - CONNECTEUR MICRO SD PUSH/PUSH REV Fabricant: MOLEX Code commande Farnell: 1366700 <http://fr.farnell.com/molex/49225-0821/connecteur-micro-sd-push-push-rev/dp/1366700?Ntt=1366700> Référence fabricant: 49225-0821
IC18 = con-hirose:FH12-30S-0.5S: 0.5mm Pitch Connectors For FPC/FFC Source: Data sheet <http://www.hirose.co.jp/cataloge_hp/e58605370.pdf>; MPN: FH12-30S-0.5SH(55); OC_FARNELL: 1324555; OC_NEWARK: 34M6176
IC19 = DS1394U-33+ RTC SPI Module:DS1394U-33+
IC23 = SP3012 TVS Diode Array:SP3012-04UTG
L1 = rcl:L-US: INDUCTOR, American symbol
L2 = DJNR3015-1R5 Inductor:DJNR3015-1R5
LED1-LED4 = led:LED: LED OSRAM: - CHIPLED LG R971, LG N971, LY N971, LG Q971, LY Q971, LO R971, LY R971 LH N974, LH R974 LS Q976, LO Q976, LY Q976 LO Q996 - Hyper CHIPLED LW Q18S LB Q993, LB Q99A, LB R99A - SideLED LS A670, LO A670, LY A670, LG A670, LP A670 LB A673, LV A673, LT A673, LW A673 LH A674 LY A675 LS A676, LA A676, LO A676, LY A676, LW A676 LS A679, LY A679, LG A679 - Hyper Micro SIDELED® LS Y876, LA Y876, LO Y876, LY Y876 LT Y87S - SmartLED LW L88C, LW L88S LB L89C, LB L89S, LG L890 LS L89K, LO L89K, LY L89K LS L896, LA L896, LO L896, LY L896 - TOPLED LS T670, LO T670, LY T670, LG T670, LP T670 LSG T670, LSP T670, LSY T670, LOP T670, LYG T670 LG T671, LOG T671, LSG T671 LB T673, LV T673, LT T673, LW T673 LH T674 LS T676, LA T676, LO T676, LY T676, LB T676, LH T676, LSB T676, LW T676 LB T67C, LV T67C, LT T67C, LS T67K, LO T67K, LY T67K, LW E67C LS E67B, LA E67B, LO E67B, LY E67B, LB E67C, LV E67C, LT E67C LW T67C LS T679, LY T679, LG T679 LS T770, LO T770, LY T770, LG T770, LP T770 LB T773, LV T773, LT T773, LW T773 LH T774 LS E675, LA E675, LY E675, LS T675 LS T776, LA T776, LO T776, LY T776, LB T776 LHGB T686 LT T68C, LB T68C - Hyper Mini TOPLED® LB M676 - Mini TOPLED Santana® LG M470 LS M47K, LO M47K, LY M47K Source: http://www.osram.convergy.de LUXEON: - LUMILED® LXK2-PW12-R00, LXK2-PW12-S00, LXK2-PW14-U00, LXK2-PW14-V00 LXK2-PM12-R00, LXK2-PM12-S00, LXK2-PM14-U00 LXK2-PE12-Q00, LXK2-PE12-R00, LXK2-PE12-S00, LXK2-PE14-T00, LXK2-PE14-U00 LXK2-PB12-K00, LXK2-PB12-L00, LXK2-PB12-M00, LXK2-PB14-N00, LXK2-PB14-P00, LXK2-PB14-Q00 LXK2-PR12-L00, LXK2-PR12-M00, LXK2-PR14-Q00, LXK2-PR14-R00 LXK2-PD12-Q00, LXK2-PD12-R00, LXK2-PD12-S00 LXK2-PH12-R00, LXK2-PH12-S00 LXK2-PL12-P00, LXK2-PL12-Q00, LXK2-PL12-R00 Source: www.luxeon.com KINGBRIGHT: KA-3528ASYC Source: www.kingbright.com
Q1 = ABM3B-8MHZ-10-1-U-T - Quartz Resonator:ABM3B
Q2 = LFXTAL016178R 32.768kHz crystal:LFXTAL016178R
R1 R3-R5 R7-R9 R12 R13 R16-R20 R25 R26 R32-R34 R37 R39-R41 R44 R45 = rcl:R-EU_: RESISTOR, European symbol
R2 R6 R10 R14 R15 R22 R23 R27-R30 R35 R36 R42 R43 R46 R47 = resistor:R-EU_: RESISTOR, European symbol
SJ3 = jumper:SJ: SMD solder JUMPER
SW1 = Wurth_Elektronik_Electromechanic_Switch_rev17c:430152050836: 6x6 mm SMD WS-TASV <http://katalog.we-online.de/media/images/v2/Family_WS-TASV_6x6mm_SMD_Tact_Switch_4301820xx8xx.jpg> Details see: http://katalog.we-online.de/em/datasheet/4301x2xxx8x6.pdf 2015 (C) Würth Elektronik
SW2 = smd-special:SWS001: SMD Dip Switch 1 pol.
SW3 = micro joystick:MICROJOYSTICK
SW4 SW5 = PB6156RSL Illuminated Tact SPST-NO switch:PB6156RSL
T1 = transistor-small-signal:BSS84: P-CHANNEL MOS FET
TP1-TP3 = testpad:TP: Test pad
TP4-TP8 TP11 = testpad:PTR1: TEST PIN

## Module BOARD2BOARD
Ports: GND(io) VCC(io)

### Library data of the parts

## Net classes
0 GND: width 0.4 mm, drill 0.25 mm, clearance 0.1 mm
1 VCC: width 0.6 mm, drill 0.25 mm, clearance 0.1 mm to class 0, clearance 0.1 mm
2 signal: width 0.25 mm, drill 0.25 mm, clearance 0.1 mm to class 0, clearance 0.1 mm to class 1, clearance 0.1 mm
3 signal cross-board: width 0.25 mm, drill 0.25 mm, clearance 0.1 mm to class 0, clearance 0.1 mm to class 1, clearance 0.1 mm to class 2, clearance 0.1 mm